# Altium project HydroPWNics Cape.PrjPcb
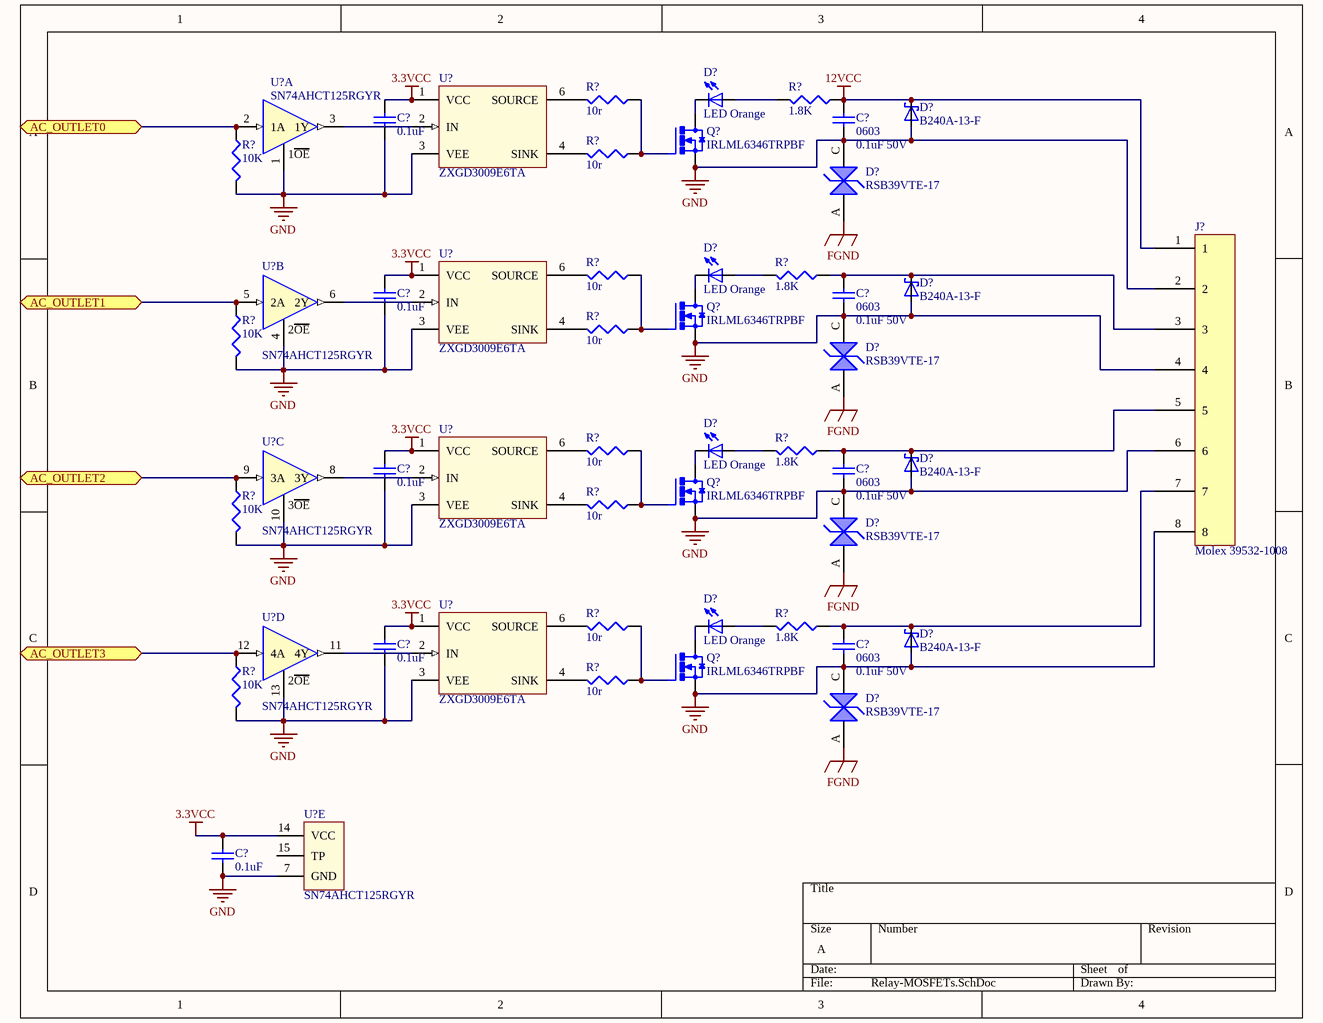
[diagram p0: Relay-MOSFETs.SchDoc]
5 sheets, 58 parts. Net scope: flat (ports and power ports of the same name join across sheets).
Sheets:
  System.SchDoc
  Relay-MOSFETs.SchDoc
  WiFi Modules.SchDoc
  Power and PWR-Managment.SchDoc
  Beaglebone Green Headers.SchDoc

## Sheet System.SchDoc
size A

## Sheet Relay-MOSFETs.SchDoc
size A

### Parts
(Parts that share a designator on the sheet are numbered #1, #2 ... from top to bottom, then left to right.)
C?#1  0.1uF  [C0402]
C?#2  0603  value 0.1uF 50V  [C0603]
C?#3  0.1uF  [C0402]
C?#4  0603  value 0.1uF 50V  [C0603]
C?#5  0.1uF  [C0402]
C?#6  0603  value 0.1uF 50V  [C0603]
C?#7  0.1uF  [C0402]
C?#8  0603  value 0.1uF 50V  [C0603]
C?#9  0.1uF  [C0402]
D?#1  LED Orange  [LED0603_ORANGE]
D?#2  B240A-13-F  [B240A-13-F]
D?#3  RSB39VTE-17  [RSB39VTE-17]
D?#4  LED Orange  [LED0603_ORANGE]
D?#5  B240A-13-F  [B240A-13-F]
D?#6  RSB39VTE-17  [RSB39VTE-17]
D?#7  LED Orange  [LED0603_ORANGE]
D?#8  B240A-13-F  [B240A-13-F]
D?#9  RSB39VTE-17  [RSB39VTE-17]
D?#10  LED Orange  [LED0603_ORANGE]
D?#11  B240A-13-F  [B240A-13-F]
D?#12  RSB39VTE-17  [RSB39VTE-17]
J?  Molex 39532-1008  [39532-1008]
Q?#1  IRLML6346TRPBF
Q?#2  IRLML6346TRPBF
Q?#3  IRLML6346TRPBF
Q?#4  IRLML6346TRPBF
R?#1  10r  [R0402]
R?#2  1.8K  [R0402]
R?#3  10r  [R0402]
R?#4  10K  [R0402]
R?#5  10r  [R0402]
R?#6  1.8K  [R0402]
R?#7  10r  [R0402]
R?#8  10K  [R0402]
R?#9  10r  [R0402]
R?#10  1.8K  [R0402]
R?#11  10r  [R0402]
R?#12  10K  [R0402]
R?#13  10r  [R0402]
R?#14  1.8K  [R0402]
R?#15  10r  [R0402]
R?#16  10K  [R0402]
U?#1  SN74AHCT125RGYR  [SN74AHCT125RGYR]  (part A of 5)
U?#2  ZXGD3009E6TA  [ZXGD3009E6TA]
U?#3  ZXGD3009E6TA  [ZXGD3009E6TA]
U?#4  SN74AHCT125RGYR  [SN74AHCT125RGYR]  (part B of 5)
U?#5  SN74AHCT125RGYR  [SN74AHCT125RGYR]  (part C of 5)
U?#6  ZXGD3009E6TA  [ZXGD3009E6TA]
U?#7  SN74AHCT125RGYR  [SN74AHCT125RGYR]  (part D of 5)
U?#8  ZXGD3009E6TA  [ZXGD3009E6TA]
U?#9  SN74AHCT125RGYR  [SN74AHCT125RGYR]  (part E of 5)

### Ports
AC_OUTLET0, AC_OUTLET1, AC_OUTLET2, AC_OUTLET3

### Nets
3.3VCC: C?#1.2 C?#3.2 C?#5.2 C?#7.2 C?#9.2 U?#2.1(VCC) U?#3.1(VCC) U?#6.1(VCC) U?#8.1(VCC) U?#9.14(VCC)
12VCC: C?#2.2 D?#2.C J?.1 R?#2.1
FGND: D?#3.A D?#6.A D?#9.A D?#12.A
GND: C?#1.1 C?#2.1 C?#3.1 C?#4.1 C?#5.1 C?#6.1 C?#7.1 C?#8.1 C?#9.1 D?#2.A D?#3.C D?#5.A D?#6.C D?#8.A D?#9.C D?#11.A D?#12.C J?.2 J?.4 J?.6 J?.8 Q?#1.1(S) Q?#1.2(S) Q?#1.3(S) Q?#2.1(S) Q?#2.2(S) Q?#2.3(S) Q?#3.1(S) Q?#3.2(S) Q?#3.3(S) Q?#4.1(S) Q?#4.2(S) Q?#4.3(S) R?#4.2 R?#8.2 R?#12.2 R?#16.2 U?#1.1(1OE) U?#2.3(VEE) U?#3.3(VEE) U?#4.4(2OE) U?#5.10(3OE) U?#6.3(VEE) U?#7.13(4OE) U?#8.3(VEE) U?#9.7(GND)
NetC?#4_2: C?#4.2 D?#5.C J?.3 R?#6.1
NetC?#6_2: C?#6.2 D?#8.C J?.5 R?#10.1
NetC?#8_2: C?#8.2 D?#11.C J?.7 R?#14.1
NetD?#1_1: D?#1.1 R?#2.2
NetD?#1_2: D?#1.2 Q?#1.MB(D)
NetD?#4_1: D?#4.1 R?#6.2
NetD?#4_2: D?#4.2 Q?#2.MB(D)
NetD?#7_1: D?#7.1 R?#10.2
NetD?#7_2: D?#7.2 Q?#3.MB(D)
NetD?#10_1: D?#10.1 R?#14.2
NetD?#10_2: D?#10.2 Q?#4.MB(D)
NetQ?#1_4: Q?#1.4(G) R?#1.8 R?#3.8
NetQ?#2_4: Q?#2.4(G) R?#5.8 R?#7.8
NetQ?#3_4: Q?#3.4(G) R?#9.8 R?#11.8
NetQ?#4_4: Q?#4.4(G) R?#13.8 R?#15.8
NetR?#1_1: R?#1.1 U?#2.6(SOURCE)
NetR?#3_1: R?#3.1 U?#2.4(SINK)
NetR?#4_1: R?#4.1 U?#1.2(1A) ; port AC_OUTLET0
NetR?#5_1: R?#5.1 U?#3.6(SOURCE)
NetR?#7_1: R?#7.1 U?#3.4(SINK)
NetR?#8_1: R?#8.1 U?#4.5(2A) ; port AC_OUTLET1
NetR?#9_1: R?#9.1 U?#6.6(SOURCE)
NetR?#11_1: R?#11.1 U?#6.4(SINK)
NetR?#12_1: R?#12.1 U?#5.9(3A) ; port AC_OUTLET2
NetR?#13_1: R?#13.1 U?#8.6(SOURCE)
NetR?#15_1: R?#15.1 U?#8.4(SINK)
NetR?#16_1: R?#16.1 U?#7.12(4A) ; port AC_OUTLET3
NetU?#1_3: U?#1.3(1Y) U?#2.2(IN)
NetU?#3_2: U?#3.2(IN) U?#4.6(2Y)
NetU?#5_8: U?#5.8(3Y) U?#6.2(IN)
NetU?#7_11: U?#7.11(4Y) U?#8.2(IN)

Not connected (* = marked no-connect by the designer): U?#9 15(TP)

### Library data of the parts
C?#1 C?#3 C?#5 C?#7 C?#9 = CL05B104JP5NNNC: CAP CER 0.1UF 10V X7R 0402; MFR: Samsung Electro-Mechanics America, Inc.; Pin Count #: 2; Tolerance: 5%; Type: Passive/Ceramic Cap; Lead-Free ?: Yes; Voltage: 10; Designer: Adam Vadala-Roth; MFR #: CL05B104JP5NNNC; Status: Active; Mounting: SMT/SMD; Datasheet: https://www.samsungsem.com/kr/front/downloadcms.do?path=/kr/support/product-search/mlcc/__icsFiles/afieldfile/2014/11/05&fileName=C_CL05B104JP5NNNC.pdf; Height: 0.55mm; Cost: 0.00758 @ 10,000; Date Created: 2 Apr 2016; Last Modified: 2 Apr 2016; Value: 0.1uF
C?#2 C?#4 C?#6 C?#8 = CL10B104KB8SFNC: CAP CER 0.1UF 50V 10% X7R 0603; MFR: Samsung; Voltage: 50VDC; Published: 10 - Dec - 2014; LatestRevisionDate: April 2015; Component Type: Chip Capacitor; MFR Part #: CL10B104KB8SFNC; Part Description: CAP CER 0.1UF 50V 10% X7R 0603; Mounting Type: SMT 0603; Datasheet: http://www.samsungsem.com/kr/front/downloadcms.do?path=/kr/support/product-search/mlcc/__icsFiles/afieldfile/2014/11/05&fileName=S_CL10B104KB8SFNC.pdf; Height: 0.9mm; Tolerance: 10%; Digikey #: 1276-1936-1-ND; PackageReference: 0603
D?#1 D?#4 D?#7 D?#10 = LTST-C191KFKT: LED ORANGE CLEAR 0603 SMD; MFR: Lite-On Inc.; Pin Count #: 2; Type: Passive/LED; Lead-Free ?: yes; Voltage: 2V; Designer: Adam Vadala-Roth; MFR #: LTST-C191KFKT; Status: Active; Mounting: SMT/SMD; Datasheet: http://optoelectronics.liteon.com/upload/download/DS22-2000-222/S_110_LTST-C191KFKT.pdf; Height: 0.55mm; Tolerance: N/A; Cost: 0.03760 @ 5000; Date Created: 4 Apr 2016; Last Modified: 4 Apr 2016; Value: LED Orange
D?#2 D?#5 D?#8 D?#11 = B240A-13-F: DIODE SCHOTTKY 40V 2A SMA; MFR: Diodes-Incorporated; Pin Count #: 2; Type: Schottky Diode; Lead-Free ?: Yes; Designer: Adam Vadala-Roth; MFR #: B240A-13-F; Status: Active; Mounting: SMT/SMD; Datasheet: http://www.diodes.com/_files/datasheets/ds13004.pdf; Height: 2.3mm; Tolerance: *; Cost: 0.0935 @ 10K; Voltage: 40V; Date Created: 6 May 2016; Last Modified: 6 May 2016
D?#3 D?#6 D?#9 D?#12 = RSB39VTE-17: TVS DIODE 30VWM SOD323; MFR: Rohm-Semiconductor; Pin Count #: 2; Lead-Free ?: Yes; Voltage: 30V; Designer: Adam Vadala-Roth; MFR #: RSB39VTE-17; Status: Active; Mounting: SMT/SMD; Datasheet: http://rohmfs.rohm.com/en/products/databook/datasheet/discrete/diode/zener/rsb39v.pdf; Height: 0.9mm; Tolerance: *; Cost: 0.07326 @ 6K; Type: TVS Diode; Date Created: 6 May 2016; Last Modified: 6 May 2016
J? = 39532-1008: 8 Position Terminal Block Header, Male Pins, Shrouded (4 Side) 0.200" (5.08mm) 90°, Right Angle Through Hole; Pin Count #: 8; Lead-Free ?: Yes; Voltage: 300V; Designer: Adam Vadala-Roth; MFR #: 39532-1008; MFR: Molex; Status: Active; Mounting: SMT/SMD; Datasheet: http://www.molex.com/pdm_docs/sd/395321002_sd.pdf; Height: 8.3mm; Tolerance: *; Cost: 1.26 @ 1000; Type: Terminal Block Header Connector; Date Created: 6 May 2016; Last Modified: 6 May 2016
Q?#1-Q?#4 = IRLML6346TRPBF: MOSFET N-CH 30V 3.4A SOT23; MFR: Infineon-Technologies-Americas-Corp.; Pin Count #: 3; Type: N-Channel MOSFET (NPN); Lead-Free ?: Yes; Designer: Adam Vadala-Roth; MFR #: IRLML6346TRPBF; Status: Active; Mounting: SMT/SMD; Datasheet: http://www.irf.com/product-info/datasheets/data/irlml6346pbf.pdf; Height: 1.12mm; Tolerance: *; Cost: 0.09720 @ 3000; Voltage: 30V; Date Created: 6 May 2016; Last Modified: 6 May 2016
R?#1 R?#3 R?#5 R?#7 R?#9 R?#11 R?#13 R?#15 = ERJ-2RKF10R0X: RES SMD 10 OHM 1% 1/10W 0402; MFR: Panasonic-Electronic-Components; Pin Count #: 2; Tolerance: 10 ohm; Lead-Free ?: Yes; Designer: Adam Vadala-Roth; MFR #: ERJ-2RKF10R0X; Status: Active; Mounting: SMT/SMD; Datasheet: http://industrial.panasonic.com/cdbs/www-data/pdf/RDA0000/AOA0000C86.pdf; Height: 0.4mm; Cost: 0.00355 @ 1000; Type: Chip Resistor / Passive; Voltage: 1/10W; Date Created: 6 May 2016; Last Modified: 6 May 2016; Value: 10r
R?#2 R?#6 R?#10 R?#14 = RC1005F182CS: RES SMD 1.8K OHM 1% 1/16W 0402; MFR: Samsung-Electro-Mechanics-America,-Inc; Pin Count #: 2; Lead-Free ?: Yes; Designer: Adam Vadala-Roth; MFR #: RC1005F182CS; Status: Active; Mounting: SMT/SMD; Datasheet: https://media.digikey.com/pdf/Data%20Sheets/Samsung%20PDFs/RC_Series_ds.pdf; Height: 0.4mm; Tolerance: 1%; Cost: 0.00203 @ 10K; Type: Passive/ Chip Resistor; Voltage: 1/16W; Date Created: 6 May 2016; Last Modified: 2 May 2016; Value: 1.8K
R?#4 R?#8 R?#12 R?#16 = RC1005F103CS: RES SMD 10K OHM 1% 1/16W 0402; MFR: Samsung Electro-Mechanics America, Inc.; Pin Count #: 2; Lead-Free ?: Yes; Designer: Adam Vadala-Roth; MFR #: RC1005F103CS; Status: Active; Mounting: SMT/SMD; Datasheet: https://media.digikey.com/pdf/Data%20Sheets/Samsung%20PDFs/RC_Series_ds.pdf; Height: 0.4mm; Tolerance: 1%; Cost: 0.00137	 @ 10000; Type: Passive / Chip Resistor; Voltage: 1/16W; Date Created: 3 Apr 2016; Last Modified: 3 Apr 2016; Value: 10K
U?#1 U?#4 U?#5 U?#7 U?#9 = SN74AHCT125RGYR: IC BUS BUFFER TRI-ST QD 14VQFN; MFR: Texas Instruments; Pin Count #: 15; Lead-Free ?: Yes; Voltage: 3.3V / 5V; Designer: Adam Vadala-Roth; MFR #: SN74AHCT125RGYR; Status: Active; Mounting: SMT/SMD; Datasheet: http://www.ti.com/lit/ds/symlink/sn74ahct125.pdf; Height: 1mm; Tolerance: *; Cost: 0.116 @ 15K; Type: 74 Logic IC; Date Created: 6 May 2016; Last Modified: 6 May 2016
U?#2 U?#3 U?#6 U?#8 = ZXGD3009E6TA: IC GATE DRVR IGBT/MOSFET SOT23-6; MFR: Diodes-Incorporated; Pin Count #: 6; Lead-Free ?: Yes; Voltage: 40V MAX; Designer: Adam Vadala-Roth; MFR #: ZXGD3009E6TA; Status: Active; Mounting: SMT/SMD; Datasheet: http://www.diodes.com/_files/datasheets/ZXGD3009E6.pdf; Height: 1.3mm; Tolerance: *; Cost: 0.121 @ 6K; Type: MOSFET Gate Driver IC; Date Created: 6 May 2016; Last Modified: 6 May 2016

## Sheet WiFi Modules.SchDoc
size A

## Sheet Power and PWR-Managment.SchDoc
size A
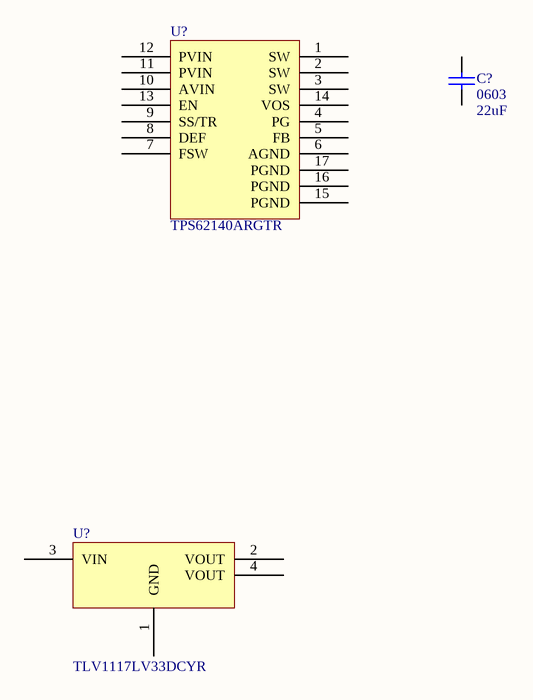
[diagram p1: Power and PWR-Managment.SchDoc]

### Parts
(Parts that share a designator on the sheet are numbered #1, #2 ... from top to bottom, then left to right.)
C?#10  0603  value 22uF  [C0603]
U?#10  TPS62140ARGTR  [TPS62140ARGTR]
U?#11  TLV1117LV33DCYR  [TLV1117LV - SOT230P700X180-4N]

### Nets

Not connected (* = marked no-connect by the designer): C?#10 1 2; U?#10 1(SW) 2(SW) 3(SW) 4(PG) 5(FB) 6(AGND) 7(FSW) 8(DEF) 9(SS/TR) 10(AVIN) 11(PVIN) 12(PVIN) 13(EN) 14(VOS) 15(PGND) 16(PGND) 17(PGND); U?#11 1(GND) 2(VOUT) 3(VIN) 4(VOUT)

### Library data of the parts
C?#10 = CL10A226KQ8NRNE: CAP CER 22UF 6.3V X5R 0603; MFR: Samsung Electro-Mechanics America, Inc.; Pin Count #: 2; Tolerance: 10%; Type: Capacitor / Passive; Lead-Free ?: Yes; Designer: Adam Vadala-Roth; MFR #: CL10A226KQ8NRNE; Status: Available; Mounting: SMT; Datasheet: https://media.digikey.com/pdf/Data%20Sheets/Samsung%20PDFs/CL10A226KQ8NRNE_Spec.pdf; Height: 0.9mm; Cost: $0.07416 @ 3000; Voltage: 6.3V; Date Created: 25 Feb 2016; Last Modified: 25 Feb 2016
U?#10 = TPS62140ARGTR: IC REG BUCK ADJ 2A SYNC 16QFN; MFR: Texas Instruments; Pin Count #: 17; Lead-Free ?: Yes; Voltage: 2-10VDC; Designer: Adam Vadala-Roth; MFR #: TPS62140ARGTR; Status: Active; Mounting: SMT/SMD; Datasheet: http://www.ti.com/lit/ds/symlink/tps62140a.pdf; Height: 1mm; Tolerance: *; Cost: 0.99 @ 1000; Type: DCDC Switchign Buck Converter / Voltage Regulator; Date Created: 6 May 2016; Last Modified: 6 May 2016
U?#11 = TLV1117LV33DCYR: IC REG LDO 3.3V 1A SOT223; MFR: Texs Instruments; Pin Count #: 3; Lead-Free ?: Yes; Voltage: 5.5V In 3.3v Out; Designer: Adam Vadala-Roth; MFR #: TLV1117LV33DCYR; Status: Active; Mounting: SMT/SMD; Datasheet: http://www.ti.com/lit/ds/symlink/tlv1117lv.pdf; Height: 1.8mm; Tolerance: *; Cost: 0.27 @ 1000; Type: LDO Low Drop Out Regulators / Voltage Regulator; Date Created: 6 May 2016; Last Modified: 6 May 2016

## Sheet Beaglebone Green Headers.SchDoc
size A
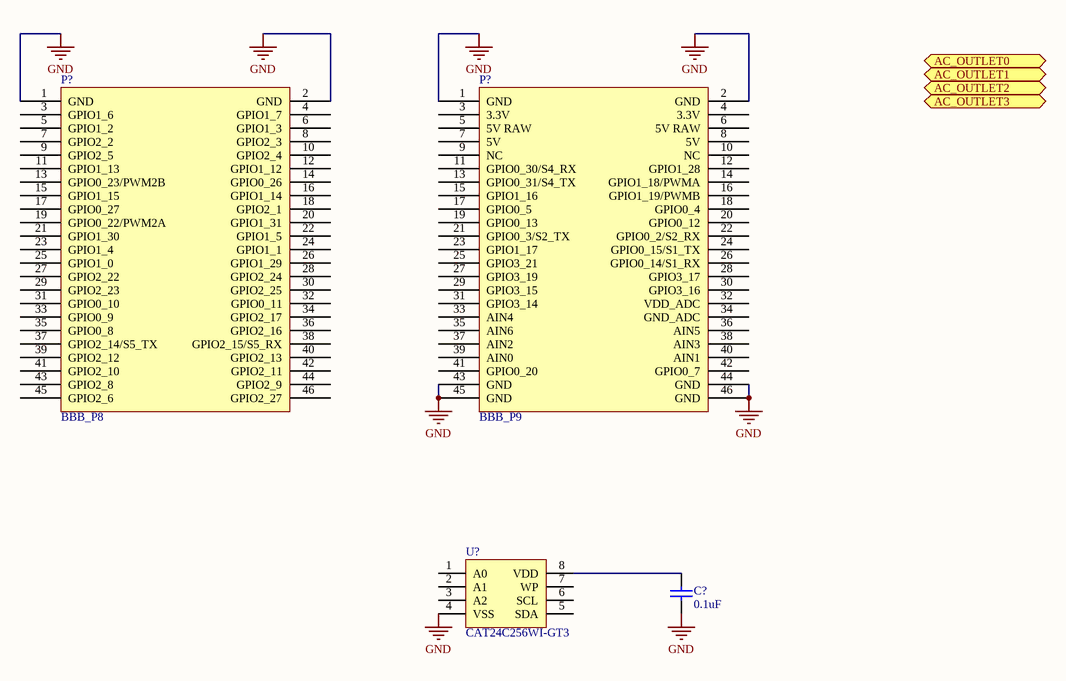
[diagram p2: Beaglebone Green Headers.SchDoc]

### Parts
(Parts that share a designator on the sheet are numbered #1, #2 ... from top to bottom, then left to right.)
C?#11  0.1uF  [C0402]
P?#1  BBB_P8  [BBB_CAPE_HEADER]
P?#2  BBB_P9  [BBB_CAPE_HEADER]
U?#12  CAT24C256WI-GT3  [CAT24C256]

### Ports
AC_OUTLET0, AC_OUTLET1, AC_OUTLET2, AC_OUTLET3

### Nets
GND: C?#11.1 P?#1.1(GND) P?#1.2(GND) P?#2.1(GND) P?#2.2(GND) P?#2.43(GND) P?#2.44(GND) P?#2.45(GND) P?#2.46(GND) U?#12.4(VSS)
NetC?#11_2: C?#11.2 U?#12.8(VDD)

Not connected (* = marked no-connect by the designer): P?#1 3(GPIO1_6) 4(GPIO1_7) 5(GPIO1_2) 6(GPIO1_3) 7(GPIO2_2) 8(GPIO2_3) 9(GPIO2_5) 10(GPIO2_4) 11(GPIO1_13) 12(GPIO1_12) 13(GPIO0_23/PWM2B) 14(GPIO0_26) 15(GPIO1_15) 16(GPIO1_14) 17(GPIO0_27) 18(GPIO2_1) 19(GPIO0_22/PWM2A) 20(GPIO1_31) 21(GPIO1_30) 22(GPIO1_5) 23(GPIO1_4) 24(GPIO1_1) 25(GPIO1_0) 26(GPIO1_29) 27(GPIO2_22) 28(GPIO2_24) 29(GPIO2_23) 30(GPIO2_25) 31(GPIO0_10) 32(GPIO0_11) 33(GPIO0_9) 34(GPIO2_17) 35(GPIO0_8) 36(GPIO2_16) 37(GPIO2_14/S5_TX) 38(GPIO2_15/S5_RX) 39(GPIO2_12) 40(GPIO2_13) 41(GPIO2_10) 42(GPIO2_11) 43(GPIO2_8) 44(GPIO2_9) 45(GPIO2_6) 46(GPIO2_27); P?#2 3(3.3V) 4(3.3V) 5(5V_RAW) 6(5V_RAW) 7(5V) 8(5V) 9(NC) 10(NC) 11(GPIO0_30/S4_RX) 12(GPIO1_28) 13(GPIO0_31/S4_TX) 14(GPIO1_18/PWMA) 15(GPIO1_16) 16(GPIO1_19/PWMB) 17(GPIO0_5) 18(GPIO0_4) 19(GPIO0_13) 20(GPIO0_12) 21(GPIO0_3/S2_TX) 22(GPIO0_2/S2_RX) 23(GPIO1_17) 24(GPIO0_15/S1_TX) 25(GPIO3_21) 26(GPIO0_14/S1_RX) 27(GPIO3_19) 28(GPIO3_17) 29(GPIO3_15) 30(GPIO3_16) 31(GPIO3_14) 32(VDD_ADC) 33(AIN4) 34(GND_ADC) 35(AIN6) 36(AIN5) 37(AIN2) 38(AIN3) 39(AIN0) 40(AIN1) 41(GPIO0_20) 42(GPIO0_7); U?#12 1(A0) 2(A1) 3(A2) 5(SDA) 6(SCL) 7(WP)

### Library data of the parts
C?#11 = CL05B104JP5NNNC: as C?#1 on sheet Relay-MOSFETs; MFR #: CL05B104JP5NNNC; Status: Active; Mounting: SMT/SMD; Datasheet: https://www.samsungsem.com/kr/front/downloadcms.do?path=/kr/support/product-search/mlcc/__icsFiles/afieldfile/2014/11/05&fileName=C_CL05B104JP5NNNC.pdf; Height: 0.55mm; Cost: 0.00758 @ 10,000; Date Created: 2 Apr 2016; Last Modified: 2 Apr 2016; Value: 0.1uF
U?#12 = CAT24C256WI-GT3: IC EEPROM 256KBIT 400KHZ 8SOIC; MFR: ON-Semiconductor; Pin Count #: 6; Lead-Free ?: Active; Voltage: 3.3v; Designer: Adam Vadala-Roth; MFR #: CAT24C256WI-GT3; Status: Active; Mounting: SMT/SMD; Datasheet: http://www.onsemi.com/pub_link/Collateral/CAT24C256-D.PDF; Height: 1.75mm; Tolerance: *; Cost: 0.21879 @ 6k; Type: EEEPROM; Date Created: 6 May 2016; Last Modified: 6 May 2016

## Nets that join several sheets
GND: Relay-MOSFETs (46 pins), Beaglebone Green Headers (10 pins)